# EasyEDA schematic Bravo-M4-UART.json

## Sheets
1 Bravo-M4-UART TX: TITLE: Bravo V1.0-M4-UART TX; REV: 1.1; Date: 2021-11-21; Sheet: 1/3; Drawn By: Kaveh Majidi (CONFIG IOI)
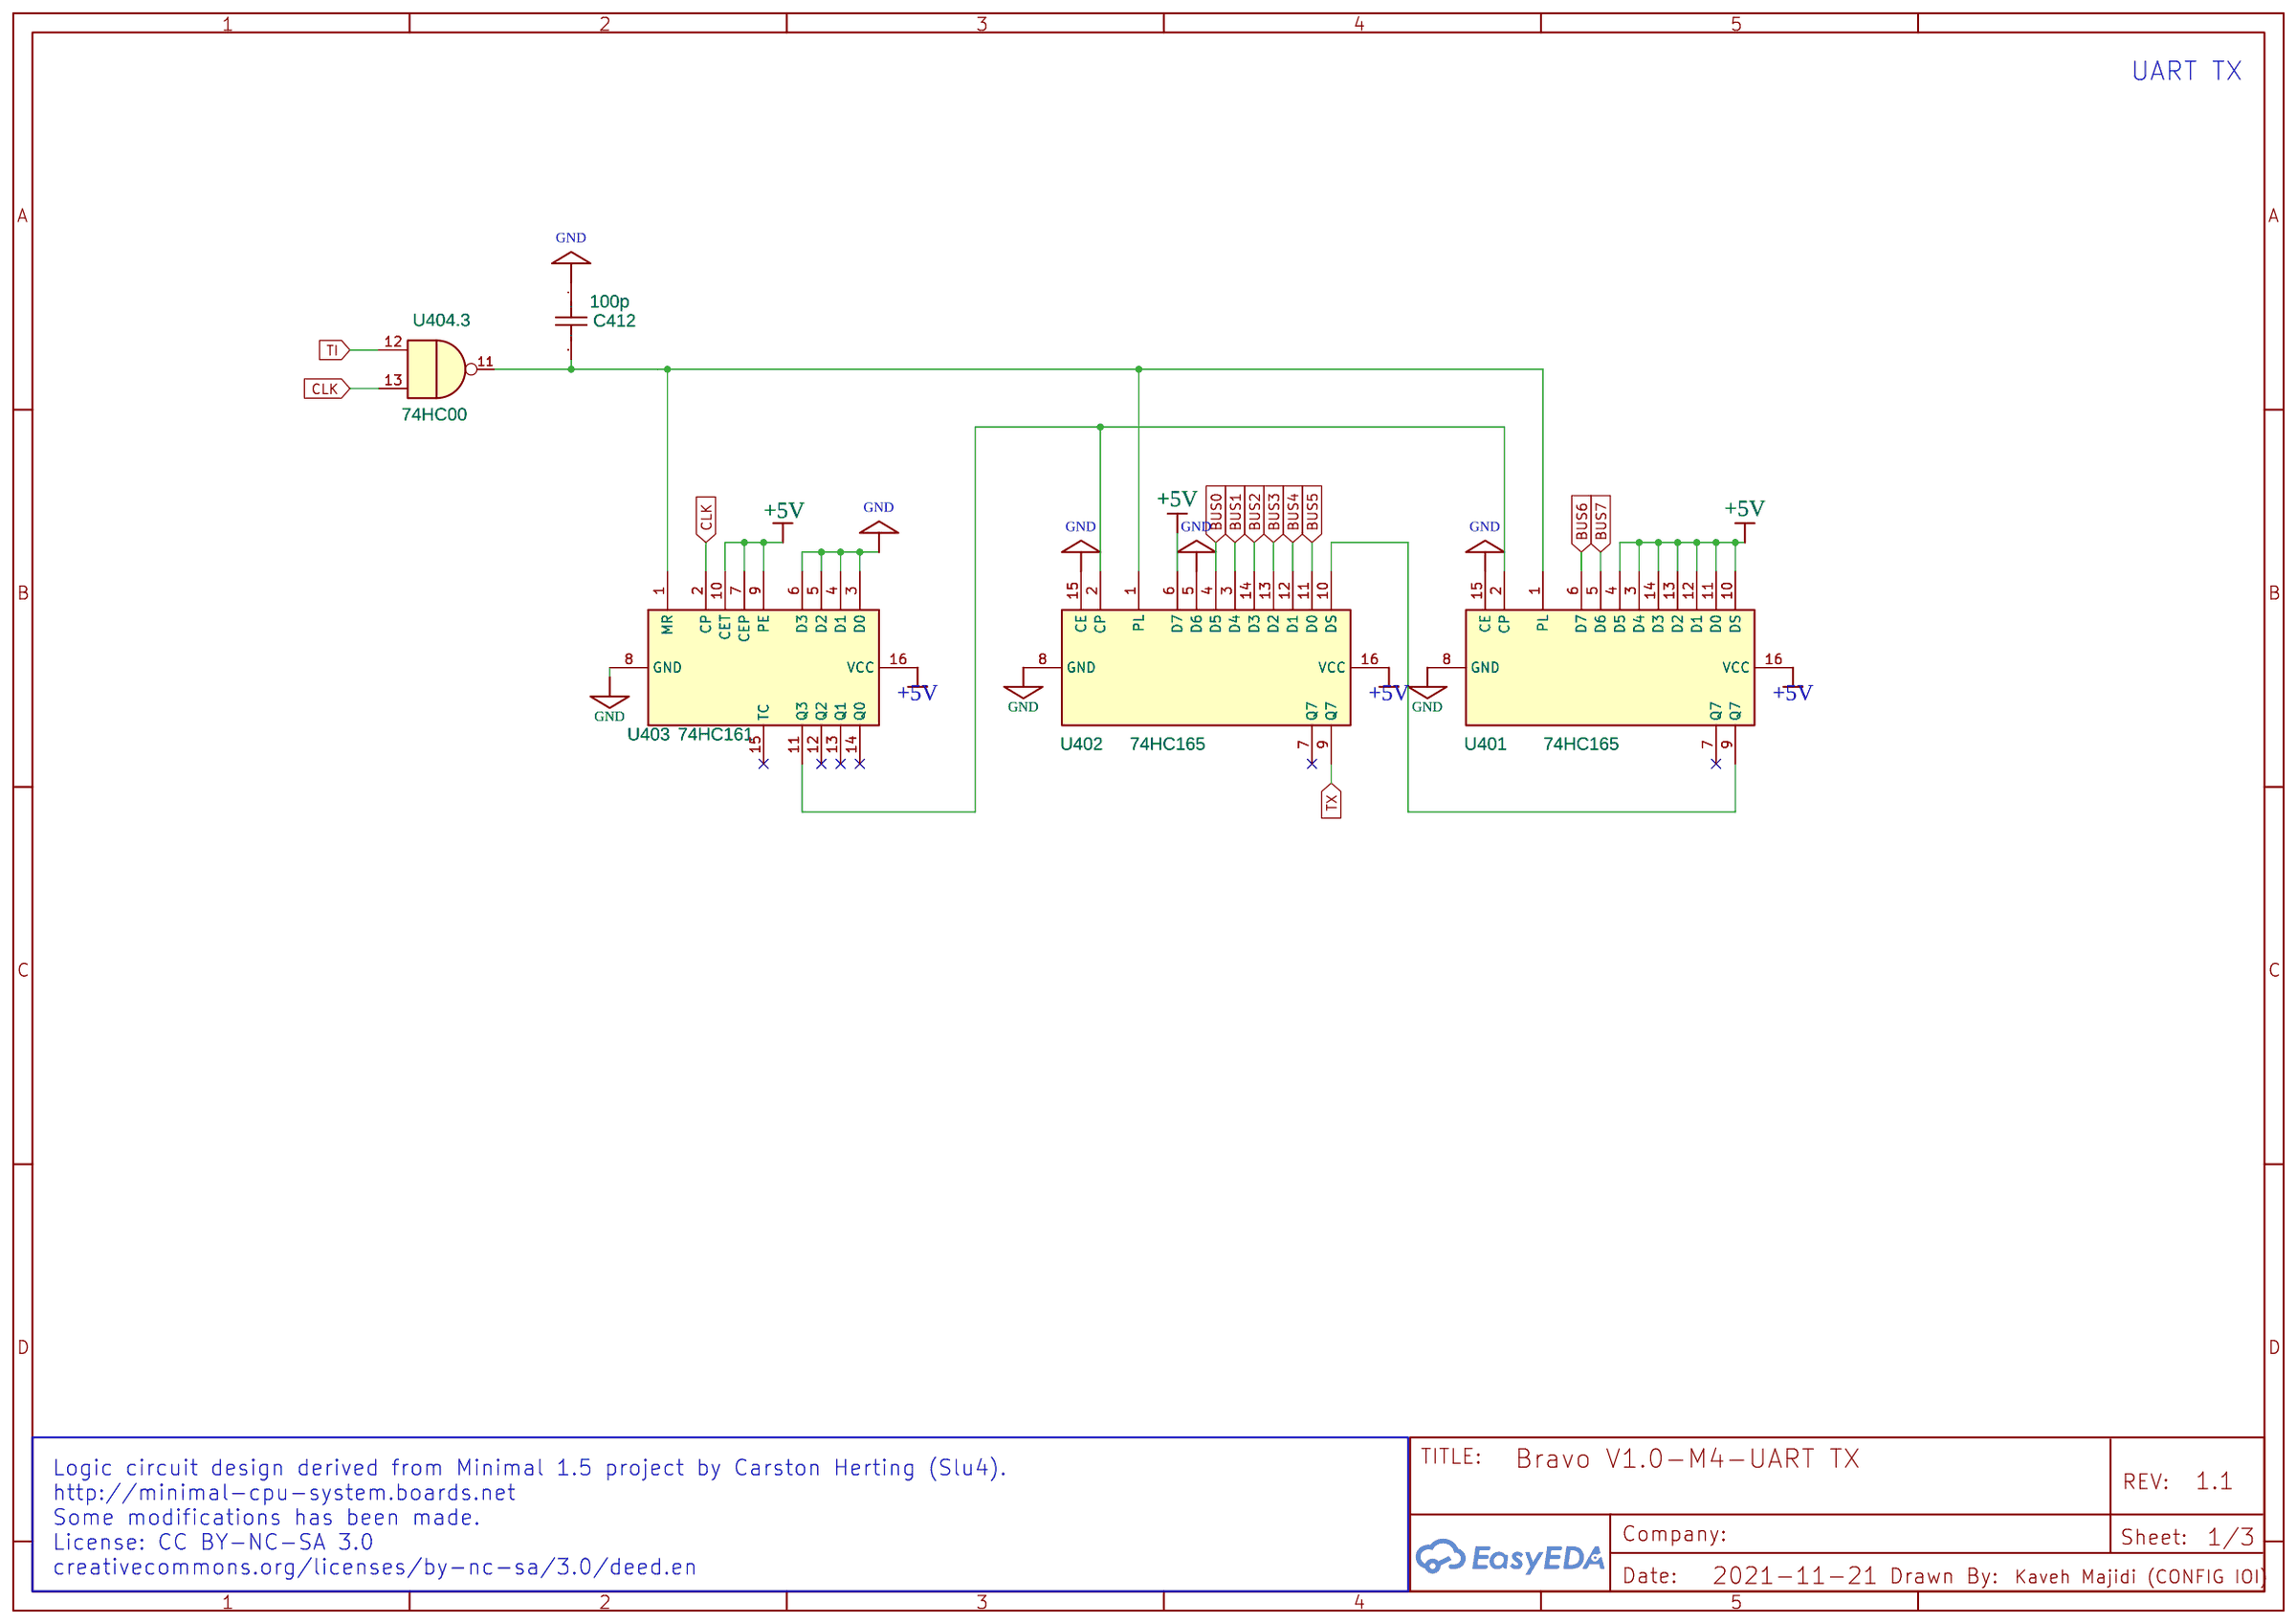
[diagram p0: Bravo-M4-UART TX]
2 Bravo-M4-UART RX: TITLE: Bravo V1.0-M4-UART RX; Date: 2021-11-23; Sheet: 2/3
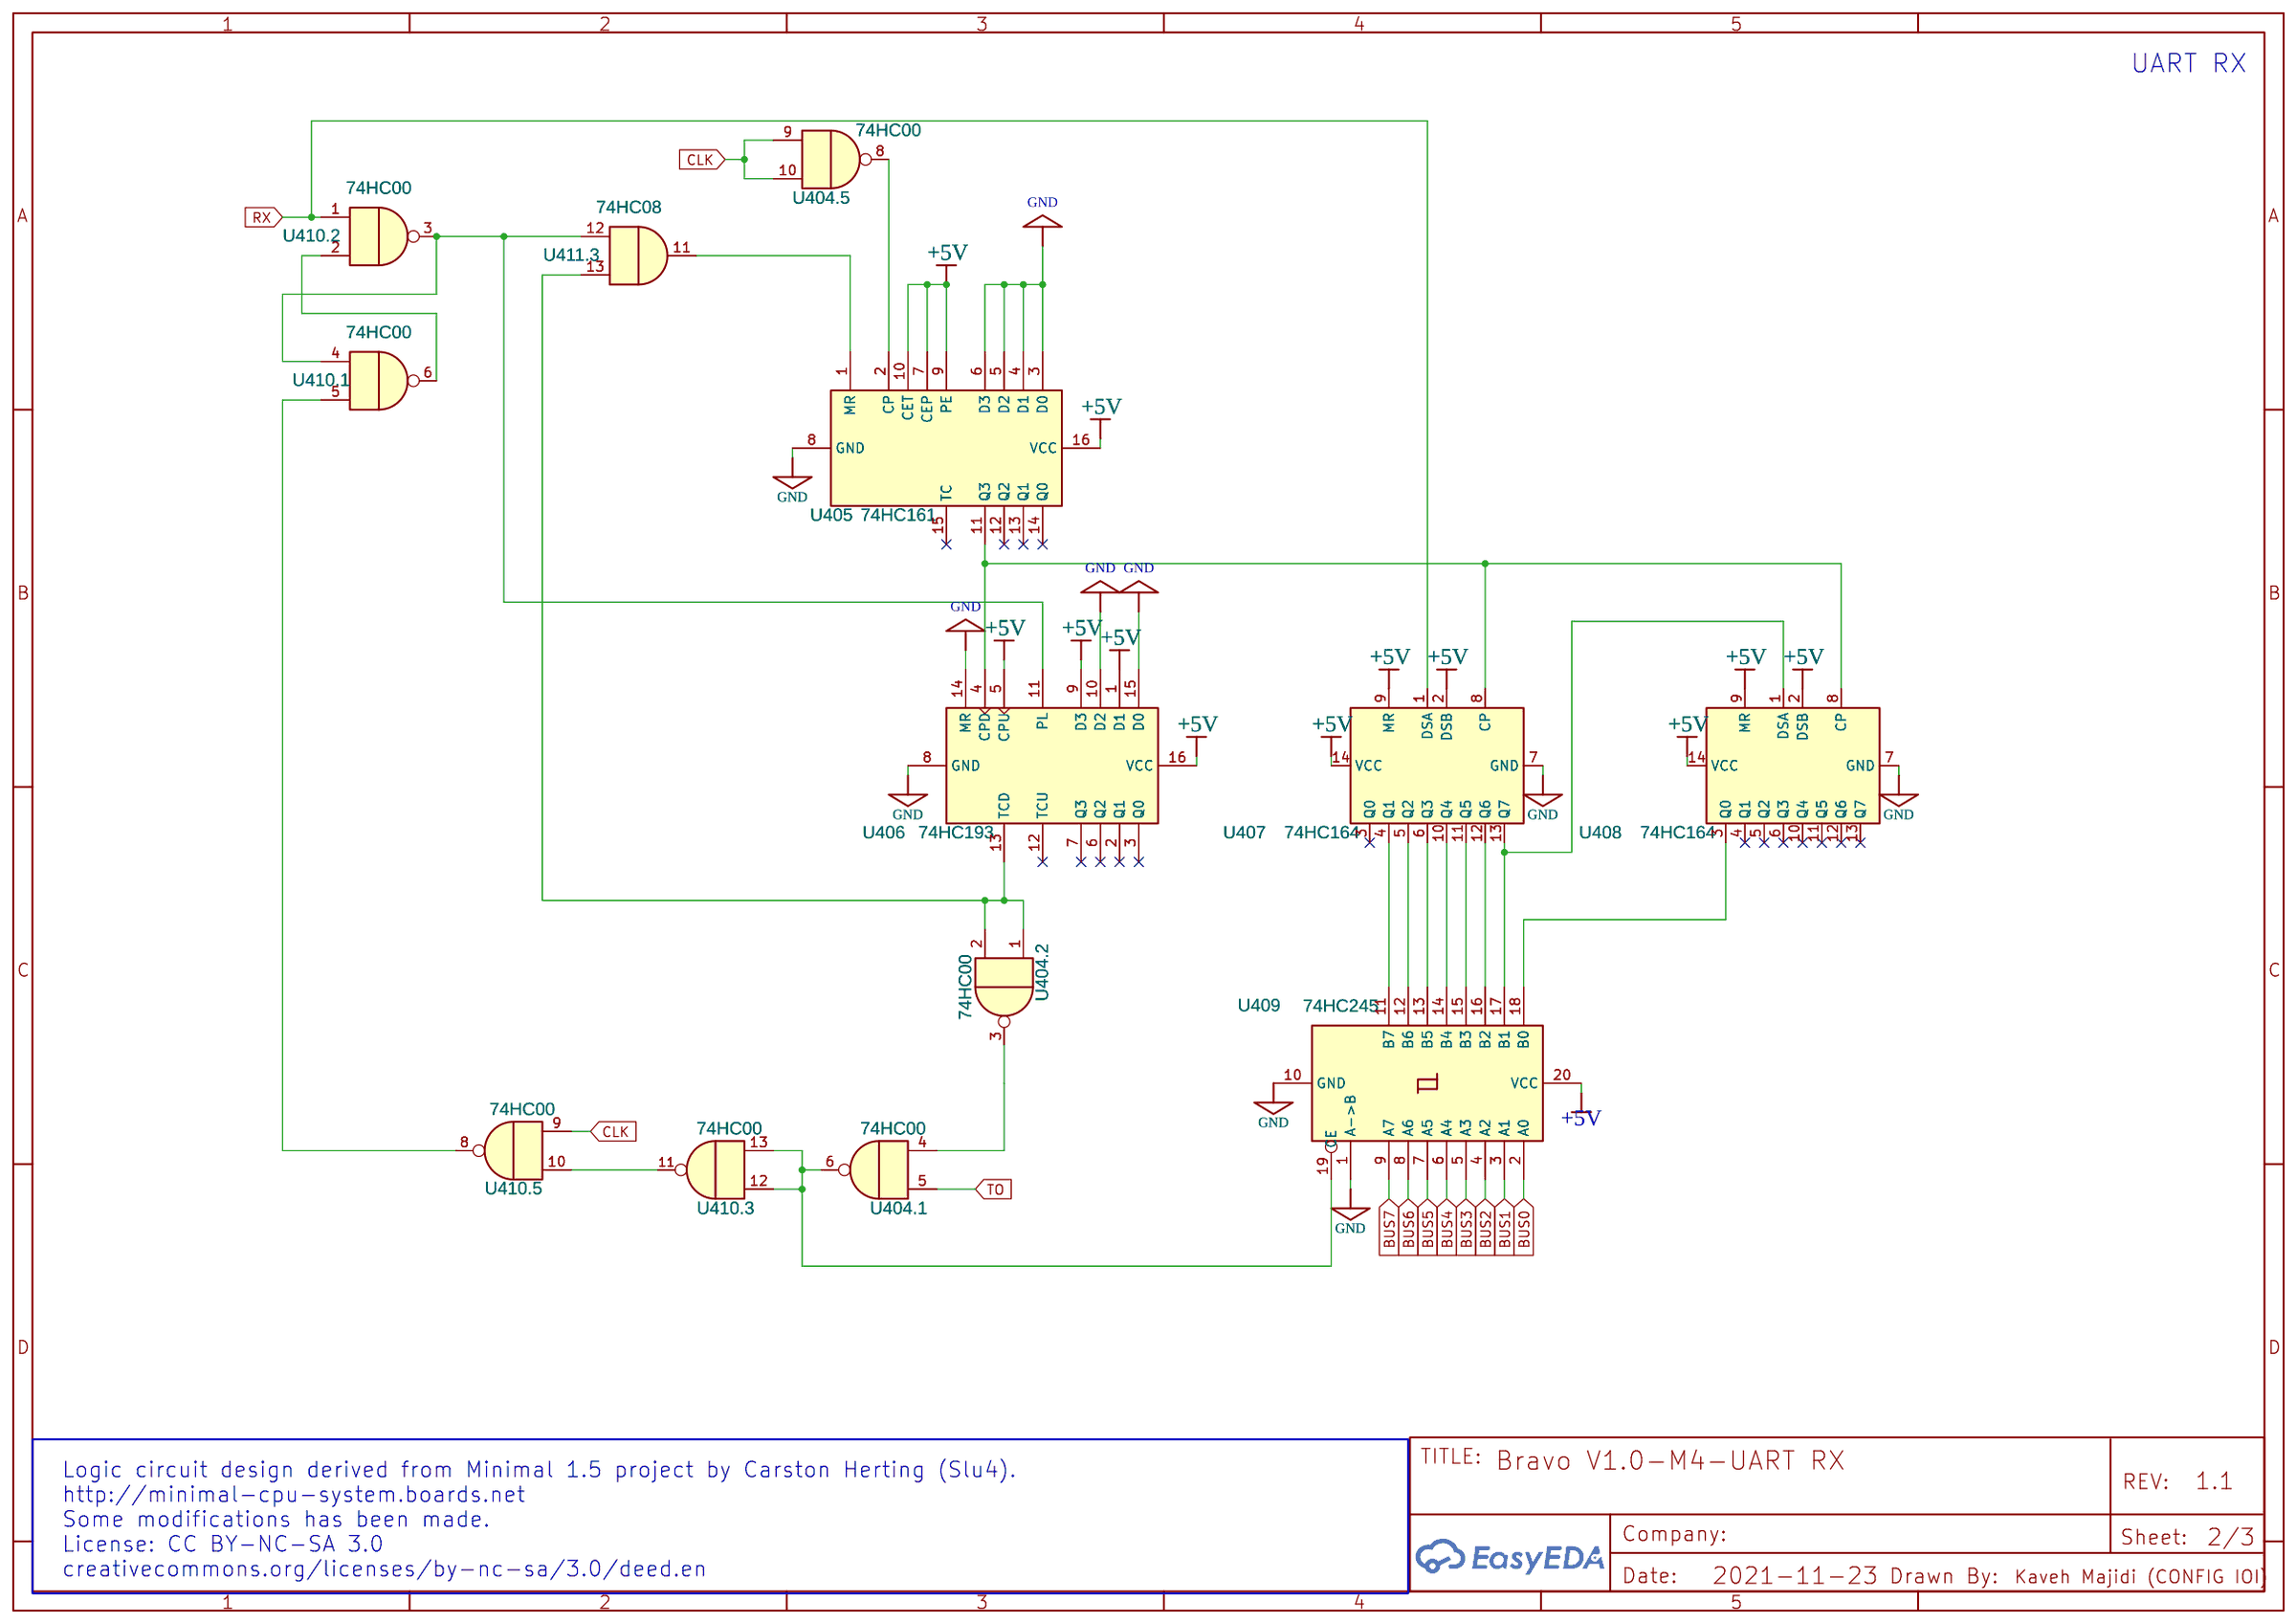
[diagram p1: Bravo-M4-UART RX]
3 Bravo-M4-Common: TITLE: Bravo V1.0-M4-Common; Date: 2021-11-23; Sheet: 3/3
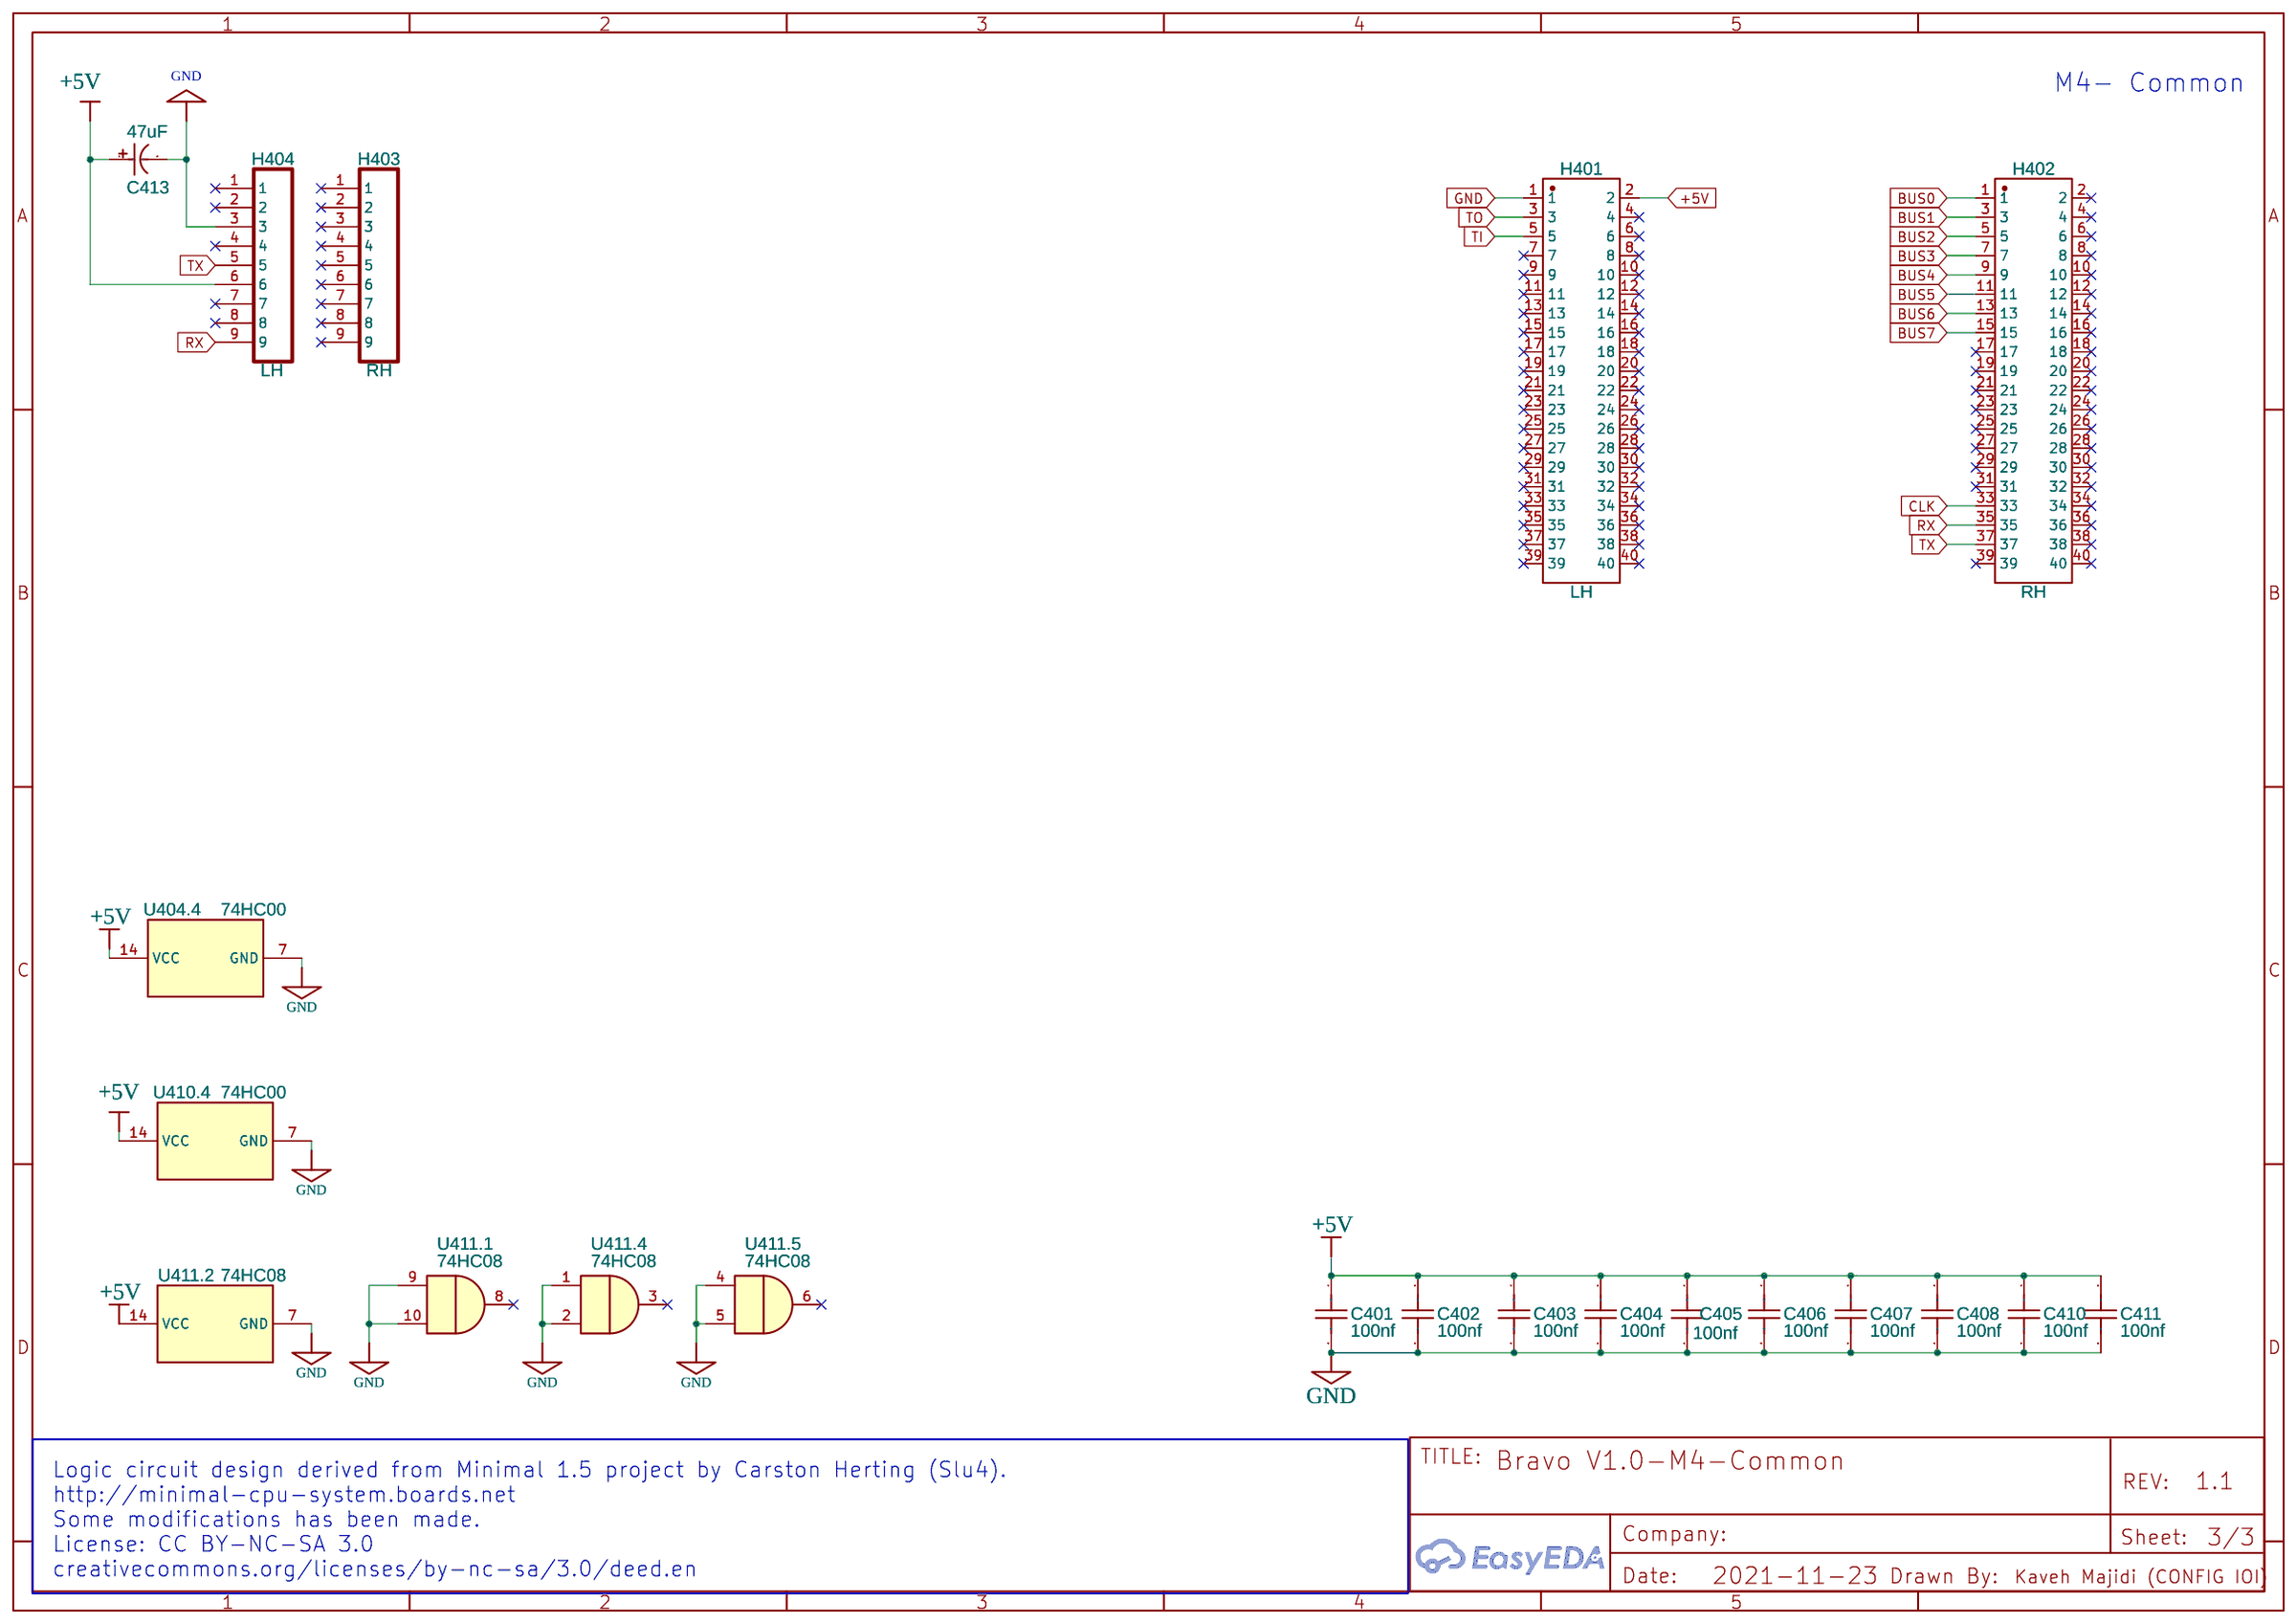
[diagram p2: Bravo-M4-Common]

## Parts
sheet Bravo-M4-Common
C401  100nf  [CAP-TH_L4.0-W2.5-P5.00-D1.0]
C402  100nf  [CAP-TH_L4.0-W2.5-P5.00-D1.0]
C403  100nf  [CAP-TH_L4.0-W2.5-P5.00-D1.0]
C404  100nf  [CAP-TH_L4.0-W2.5-P5.00-D1.0]
C405  100nf  [CAP-TH_L4.0-W2.5-P5.00-D1.0]
C406  100nf  [CAP-TH_L4.0-W2.5-P5.00-D1.0]
C407  100nf  [CAP-TH_L4.0-W2.5-P5.00-D1.0]
C408  100nf  [CAP-TH_L4.0-W2.5-P5.00-D1.0]
C410  100nf  [CAP-TH_L4.0-W2.5-P5.00-D1.0]
C411  100nf  [CAP-TH_L4.0-W2.5-P5.00-D1.0]
C413  47uF  [CAP-TH_BD5.0-P2.50-D1.0-FD]
H401  LH  [HEADER-2X20-2.54]
H402  RH  [HEADER-2X20-2.54]
H403  RH  [1X9PIN]
H404  LH  [1X9PIN]
U411  74HC08  [DIP-14_W7.62MM_SOCKET]  (sections 1,2,3,4,5)
sheet Bravo-M4-UART RX
U404  74HC00  [DIP-14_W7.62MM_SOCKET]  (sections 1,2,3,4,5)
U405  74HC161  [DIP-16_W7.62MM_SOCKET]
U406  74HC193  [DIP-16_W7.62MM_SOCKET]
U407  74HC164  [DIP-14_W7.62MM_SOCKET]
U408  74HC164  [DIP-14_W7.62MM_SOCKET]
U409  74HC245  [DIP-20-2.54MM]
U410  74HC00  [DIP-14_W7.62MM_SOCKET]  (sections 1,2,3,4,5)
sheet Bravo-M4-UART TX
C412  100p  [CAP-TH_L4.0-W2.5-P5.00-D1.0]
U401  74HC165  [DIP-16_W7.62MM_SOCKET]
U402  74HC165  [DIP-16_W7.62MM_SOCKET]
U403  74HC161  [DIP-16_W7.62MM_SOCKET]

## Library data of the parts
C401-C408 C410-C412 = CC45SL3AD220JYVNA: Supplier: LCSC; Supplier Part: C342429; Manufacturer: TDK; Contributor: LCSC
C413 = electrolytic capacitor10UF50V: Supplier: LCSC; Manufacturer: ValuePro; Supplier Part: C32856
H401 H402 = HEADER-2x20-2.54: Manufacturer Part: Headers  Pins2.54mm1*10P; image: http://image.lceda.cn/szlcsc/C57369.jpg; Supplier Part: C57369; Contributor: panasonic-spunt
H403 H404 = 1x9: Contributor: cmacarthur
U411 = 74HC08: Contributor: Sirawit Lappisatepun; subpart_no: 1
U404 U410 = 74HC00: Contributor: easyledas; subpart_no: 1
U403 U405 = 74HC161: Contributor: Thiago Mendes
U406 = 74HC193: Contributor: Vadim Bley
U407 U408 = 74HC164: Contributor: Tgio
U409 = 74HC245: Contributor: Andrew Fox
U401 U402 = 74HC165: Contributor: easyledas

## Nets
+5V: C401.1 C402.1 C403.1 C404.1 C405.1 C406.1 C407.1 C408.1 C410.1 C411.1 C413.1(+) H401.2 H404.6 U401.3(D4) U401.4(D5) U401.10(DS) U401.11(D0) U401.12(D1) U401.13(D2) U401.14(D3) U401.16(VCC) U402.6(D7) U402.16(VCC) U403.7(CEP) U403.9(PE) U403.10(CET) U403.16(VCC) U404.14(VCC) U405.7(CEP) U405.9(PE) U405.10(CET) U405.16(VCC) U406.1(D1) U406.5(CPU) U406.9(D3) U406.16(VCC) U407.2(DSB) U407.9(MR) U407.14(VCC) U408.2(DSB) U408.9(MR) U408.14(VCC) U409.20(VCC) U410.14(VCC) U411.14(VCC)
GND: C401.2 C402.2 C403.2 C404.2 C405.2 C406.2 C407.2 C408.2 C410.2 C411.2 C412.1 C413.2(-) H401.1 H404.3 U401.8(GND) U401.15(CE) U402.5(D6) U402.8(GND) U402.15(CE) U403.3(D0) U403.4(D1) U403.5(D2) U403.6(D3) U403.8(GND) U404.7(GND) U405.3(D0) U405.4(D1) U405.5(D2) U405.6(D3) U405.8(GND) U406.8(GND) U406.10(D2) U406.14(MR) U406.15(D0) U407.7(GND) U408.7(GND) U409.1(A->B) U409.10(GND) U410.7(GND) U411.1 U411.2 U411.4 U411.5 U411.7(GND) U411.9 U411.10
BUS0: H402.1 U402.4(D5) U409.2(A0)
BUS1: H402.3 U402.3(D4) U409.3(A1)
BUS2: H402.5 U402.14(D3) U409.4(A2)
BUS3: H402.7 U402.13(D2) U409.5(A3)
BUS4: H402.9 U402.12(D1) U409.6(A4)
BUS5: H402.11 U402.11(D0) U409.7(A5)
BUS6: H402.13 U401.6(D7) U409.8(A6)
BUS7: H402.15 U401.5(D6) U409.9(A7)
CLK: H402.33 U403.2(CP) U404.9 U404.10 U404.13 U410.9
RX: H402.35 H404.9 U407.1(DSA) U410.1
TI: H401.5 U404.12
TO: H401.3 U404.5
TX: H402.37 H404.5 U402.9(Q7)
Net-(C412-2): C412.2 U401.1(PL) U402.1(PL) U403.1(MR) U404.11
Net-(U401-2): U401.2(CP) U402.2(CP) U403.11(Q3)
Net-(U401-9): U401.9(Q7) U402.10(DS)
Net-(U404.1-4): U404.3 U404.4
Net-(U404.1-6): U404.6 U409.19(CE) U410.12 U410.13
Net-(U404.2-1): U404.1 U404.2 U406.13(TCD) U411.13
Net-(U404.5-8): U404.8 U405.2(CP)
Net-(U405-1): U405.1(MR) U411.11
Net-(U405-11): U405.11(Q3) U406.4(CPD) U407.8(CP) U408.8(CP)
Net-(U406-11): U406.11(PL) U410.3 U410.4 U411.12
Net-(U407-4): U407.4(Q1) U409.11(B7)
Net-(U407-5): U407.5(Q2) U409.12(B6)
Net-(U407-6): U407.6(Q3) U409.13(B5)
Net-(U407-10): U407.10(Q4) U409.14(B4)
Net-(U407-11): U407.11(Q5) U409.15(B3)
Net-(U407-12): U407.12(Q6) U409.16(B2)
Net-(U407-13): U407.13(Q7) U408.1(DSA) U409.17(B1)
Net-(U408-3): U408.3(Q0) U409.18(B0)
Net-(U410.1-5): U410.5 U410.8
Net-(U410.1-6): U410.2 U410.6
Net-(U410.3-11): U410.10 U410.11

Not connected (* = marked no-connect by the designer): H401 4* 6* 7* 8* 9* 10* 11* 12* 13* 14* 15* 16* 17* 18* 19* 20* 21* 22* 23* 24* 25* 26* 27* 28* 29* 30* 31* 32* 33* 34* 35* 36* 37* 38* 39* 40*; H402 2* 4* 6* 8* 10* 12* 14* 16* 17* 18* 19* 20* 21* 22* 23* 24* 25* 26* 27* 28* 29* 30* 31* 32* 34* 36* 38* 39* 40*; H403 1* 2* 3* 4* 5* 6* 7* 8* 9*; H404 1* 2* 4* 7* 8*; U401 7(Q7)*; U402 7(Q7)*; U403 12(Q2)* 13(Q1)* 14(Q0)* 15(TC)*; U405 12(Q2)* 13(Q1)* 14(Q0)* 15(TC)*; U406 2(Q1)* 3(Q0)* 6(Q2)* 7(Q3)* 12(TCU)*; U407 3(Q0)*; U408 4(Q1)* 5(Q2)* 6(Q3)* 10(Q4)* 11(Q5)* 12(Q6)* 13(Q7)*; U411 3* 6* 8*

## Notes on the sheets
sheet 1
- UART TX
- Logic circuit design derived from Minimal 1.5 project by Carston Herting (Slu4).
  http://minimal-cpu-system.boards.net
  Some modifications has been made.
  License: CC BY-NC-SA 3.0
  creativecommons.org/licenses/by-nc-sa/3.0/deed.en
sheet 2
- UART RX
- Logic circuit design derived from Minimal 1.5 project by Carston Herting (Slu4).
  http://minimal-cpu-system.boards.net
  Some modifications has been made.
  License: CC BY-NC-SA 3.0
  creativecommons.org/licenses/by-nc-sa/3.0/deed.en
sheet 3
- M4- Common
- Logic circuit design derived from Minimal 1.5 project by Carston Herting (Slu4).
  http://minimal-cpu-system.boards.net
  Some modifications has been made.
  License: CC BY-NC-SA 3.0
  creativecommons.org/licenses/by-nc-sa/3.0/deed.en
